# EAGLE design sao-45 (EAGLE 9.0.1)
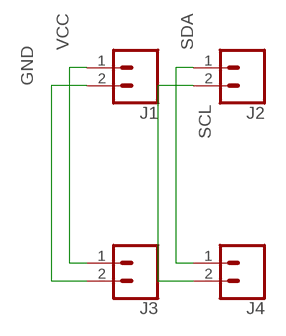
[diagram p0: schematic, sheet 1]

## Parts
J1  CONN_02LOCK  [1X02_LOCK]
J2  CONN_02LOCK  [1X02_LOCK]
J3  CONN_02LOCK  [1X02_LOCK]
J4  CONN_02LOCK  [1X02_LOCK]

## Nets
GND: J1.2 J3.2
SCL: J2.2 J4.2
SDA: J2.1 J4.1
VCC: J1.1 J3.1

## Library data of the parts
J1-J4 = SparkFun-Connectors:CONN_02: Multi connection point. Often used as Generic Header-pin footprint for 0.1 inch spaced/style header connections On any of the 0.1 inch spaced packages, you can populate with these: Break Away Headers - Straight <https://www.sparkfun.com/products/116> (PRT-00116) Break Away Male Headers - Right Angle <https://www.sparkfun.com/products/553> (PRT-00553) Female Headers <https://www.sparkfun.com/products/115> (PRT-00115) Break Away Headers - Machine Pin <https://www.sparkfun.com/products/117> (PRT-00117) Break Away Female Headers - Swiss Machine Pin <https://www.sparkfun.com/products/743> (PRT-00743) For SCREWTERMINALS and SPRING TERMINALS visit here: Screw Terimnals on SparkFun.com <https://www.sparkfun.com/search/results?term=Screw+Terminals> (5mm/3.5mm/2.54mm spacing) This device is also useful as a general connection point to wire up your design to another part of your project. Our various solder wires solder well into these plated through hole pads. Hook-Up Wire - Assortment (Stranded, 22 AWG) <https://www.sparkfun.com/products/11375> (PRT-11375) Hook-Up Wire - Assortment (Solid Core, 22 AWG) <https://www.sparkfun.com/products/11367> (PRT-11367) View the entire wire category on our website here <https://www.sparkfun.com/categories/141> Special notes: Molex polarized connector foot print use with: PRT-08233 with associated crimp pins and housings. 2.54_SCREWTERM for use with PRT-10571. 3.5mm Screw Terminal footprints for PRT-08084 5mm Screw Terminal footprints for use with PRT-08432

## Board
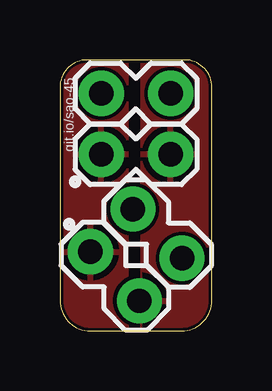
[diagram p1: board, top side]
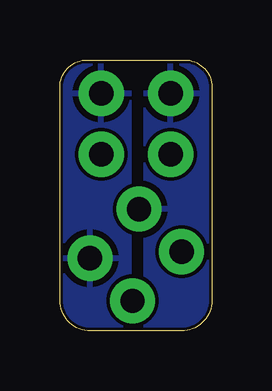
[diagram p2: board, bottom side, seen from below]

Size 6.35 x 11.3 mm. Coordinates in mm from the lower left corner, seen from the top.
Outline: 0,10.16 0,1.27 arc90 1.27,0 5.08,0 arc90 6.35,1.27 6.35,10.16 arc90 5.21,11.3 1.14,11.3 arc90 0,10.16
Copper layers (1*16): Top 0.035mm / dielectric 1.5mm / Bottom 0.035mm
Design rules "default *": minimum track width 6mil, minimum drill 0.35mm, track to track 6mil, track to pad 6mil, pad to pad 6mil, via to via 6mil, smd to smd 6mil, copper to edge 5mil, drill to drill 6mil, minimum pad ring 10mil, minimum via ring 8mil, stop-mask expansion 4mil, vias tented up to drill 0mil, thermal gap 10mil

### Footprints (pad centres in the part's own frame; a part is rotated, then mirrored left to right if it is on the bottom)
1X02_LOCK = drill 1.016 pad 1.88: 1 -0.178,0; 2 2.718,0

### Placement (x,y rotation side)
J1  1.91,7.37 0 top
J2  1.91,9.91 0 top
J3  1.4,3.17 315 top
J4  3.17,4.95 315 top

### Tracks (layer width: path | path; a pad name or v marks a point on that pad's centre or on a via)
GND
  pour Top: 3.43,-1.27 3.43,11.43 10.16,11.43 10.16,-1.27
SCL
  pour Bottom: 3.43,-1.27 3.43,11.43 10.16,11.43 10.16,-1.27
SDA
  pour Bottom: -1.27,-1.27 -1.27,12.7 2.79,12.7 2.79,-1.27
VCC
  pour Top: -1.27,-1.27 -1.27,12.7 2.79,12.7 2.79,-1.27

### Text on the board
tNames: git.io/sao-45
tStop: @securelyfitz